# Altium schematic sheet Driver.SchDoc
size A
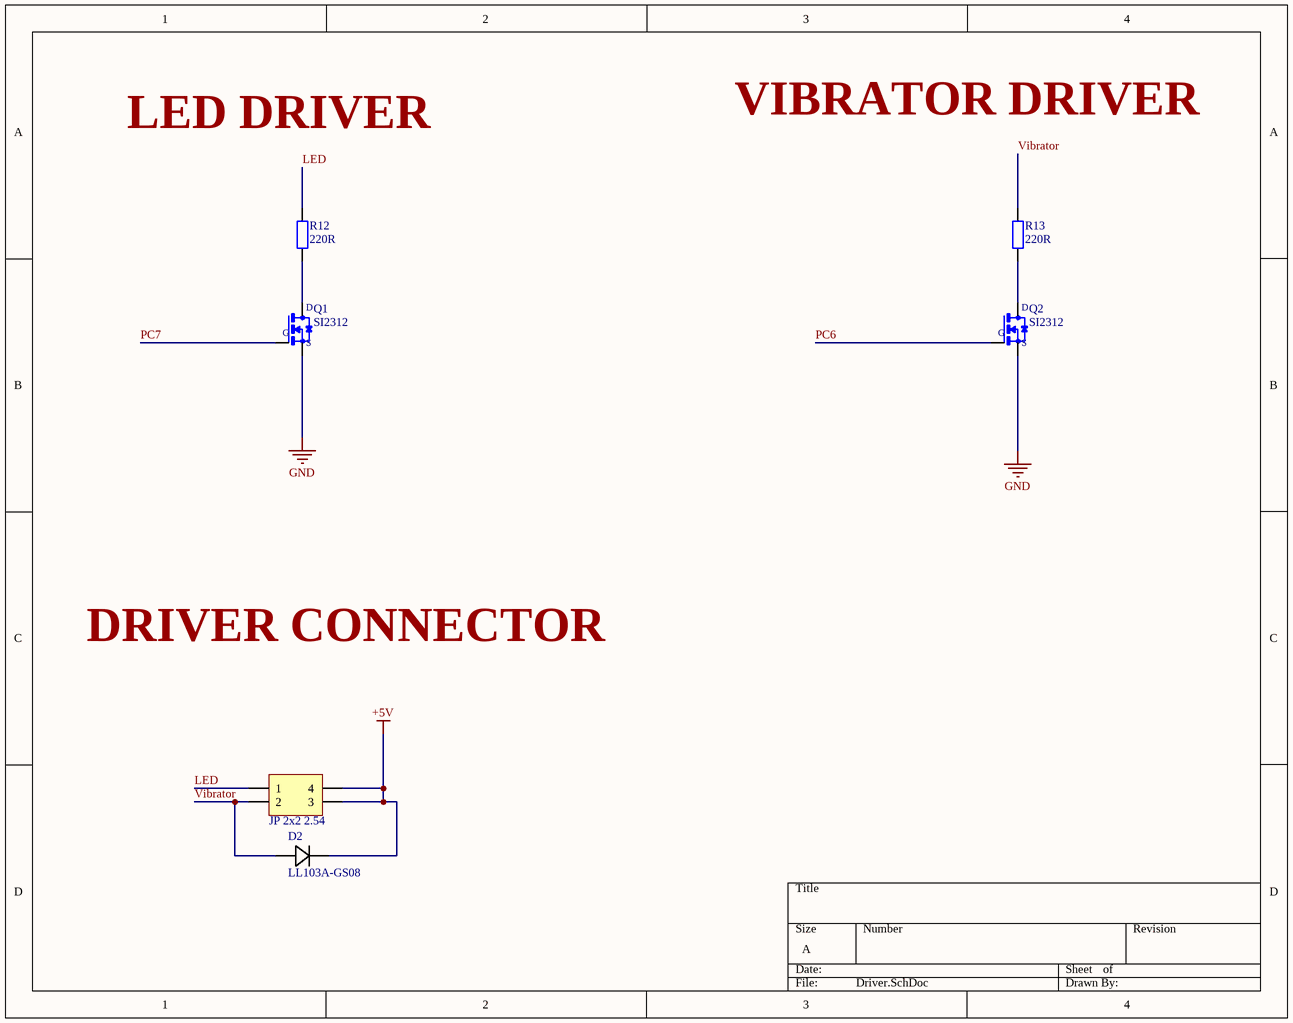
[diagram p0: Driver.SchDoc]

## Parts
D2  LL103A-GS08  [MELF_SOD-80_VIS]
JP1  JP 2x2 2.54  [JP 2x2 DT]
Q1  SI2312  [SOT23]
Q2  SI2312  [SOT23]
R12  220R  [tro smd 0603]
R13  220R  [tro smd 0603]

## Nets
+5V: D2.1 JP1.3 JP1.4
GND: Q1.2(S) Q2.2(S)
LED: JP1.1 R12.2
PC6: Q2.1(G)
PC7: Q1.1(G)
Vibrator: D2.2 JP1.2 R13.2
NetQ1_3: Q1.3(D) R12.1
NetQ2_3: Q2.3(D) R13.1

## Notes on the sheet
- LED DRIVER
- VIBRATOR DRIVER
- DRIVER CONNECTOR

## Library data of the parts
D2 = LL103A-GS08: No Description Available; Mfr_Name: Vishay
JP1 = JP 2x2 2.54 Duc Thang: Cắm; Ten_Linh_Kien: Jump Đôi Đực 2.54MM 2x40P Thẳng 11MM; Don_Vi: Con; Ma_Hang: MH002686; Ghi_Chu: *; Kieu_Chan: *; Chung_Loai: Cắm
Q1 Q2 = SI2312: <b>N-Channel MOSFET</b>    <a href="https://pricing.snapeda.com/parts/SI2312/Micro%20Commercial%20Components/view-part?ref=eda">Check availability</a> <a href="https://pricing.snapeda.com/parts/SI2312/Micro%20Commercial%20Components/view-part?ref=eda">Check availability</a>; MF: {'manufacturer': u'Micro Commercial Components'}; MP: SI2312-TP; Package: None; Price: None; Value: *; Availability: Unavailable
R12 R13 = Tro 0603 5% 220R: Dán; Don_Vi: Con; So_Chan: 2; Ten_Linh_Kien: Trở 0603 5% 220R; Ma_Hang: MH006322; Chung_Loai: Dán; Kieu_Chan: *